# EAGLE design R113A (EAGLE 4.11)
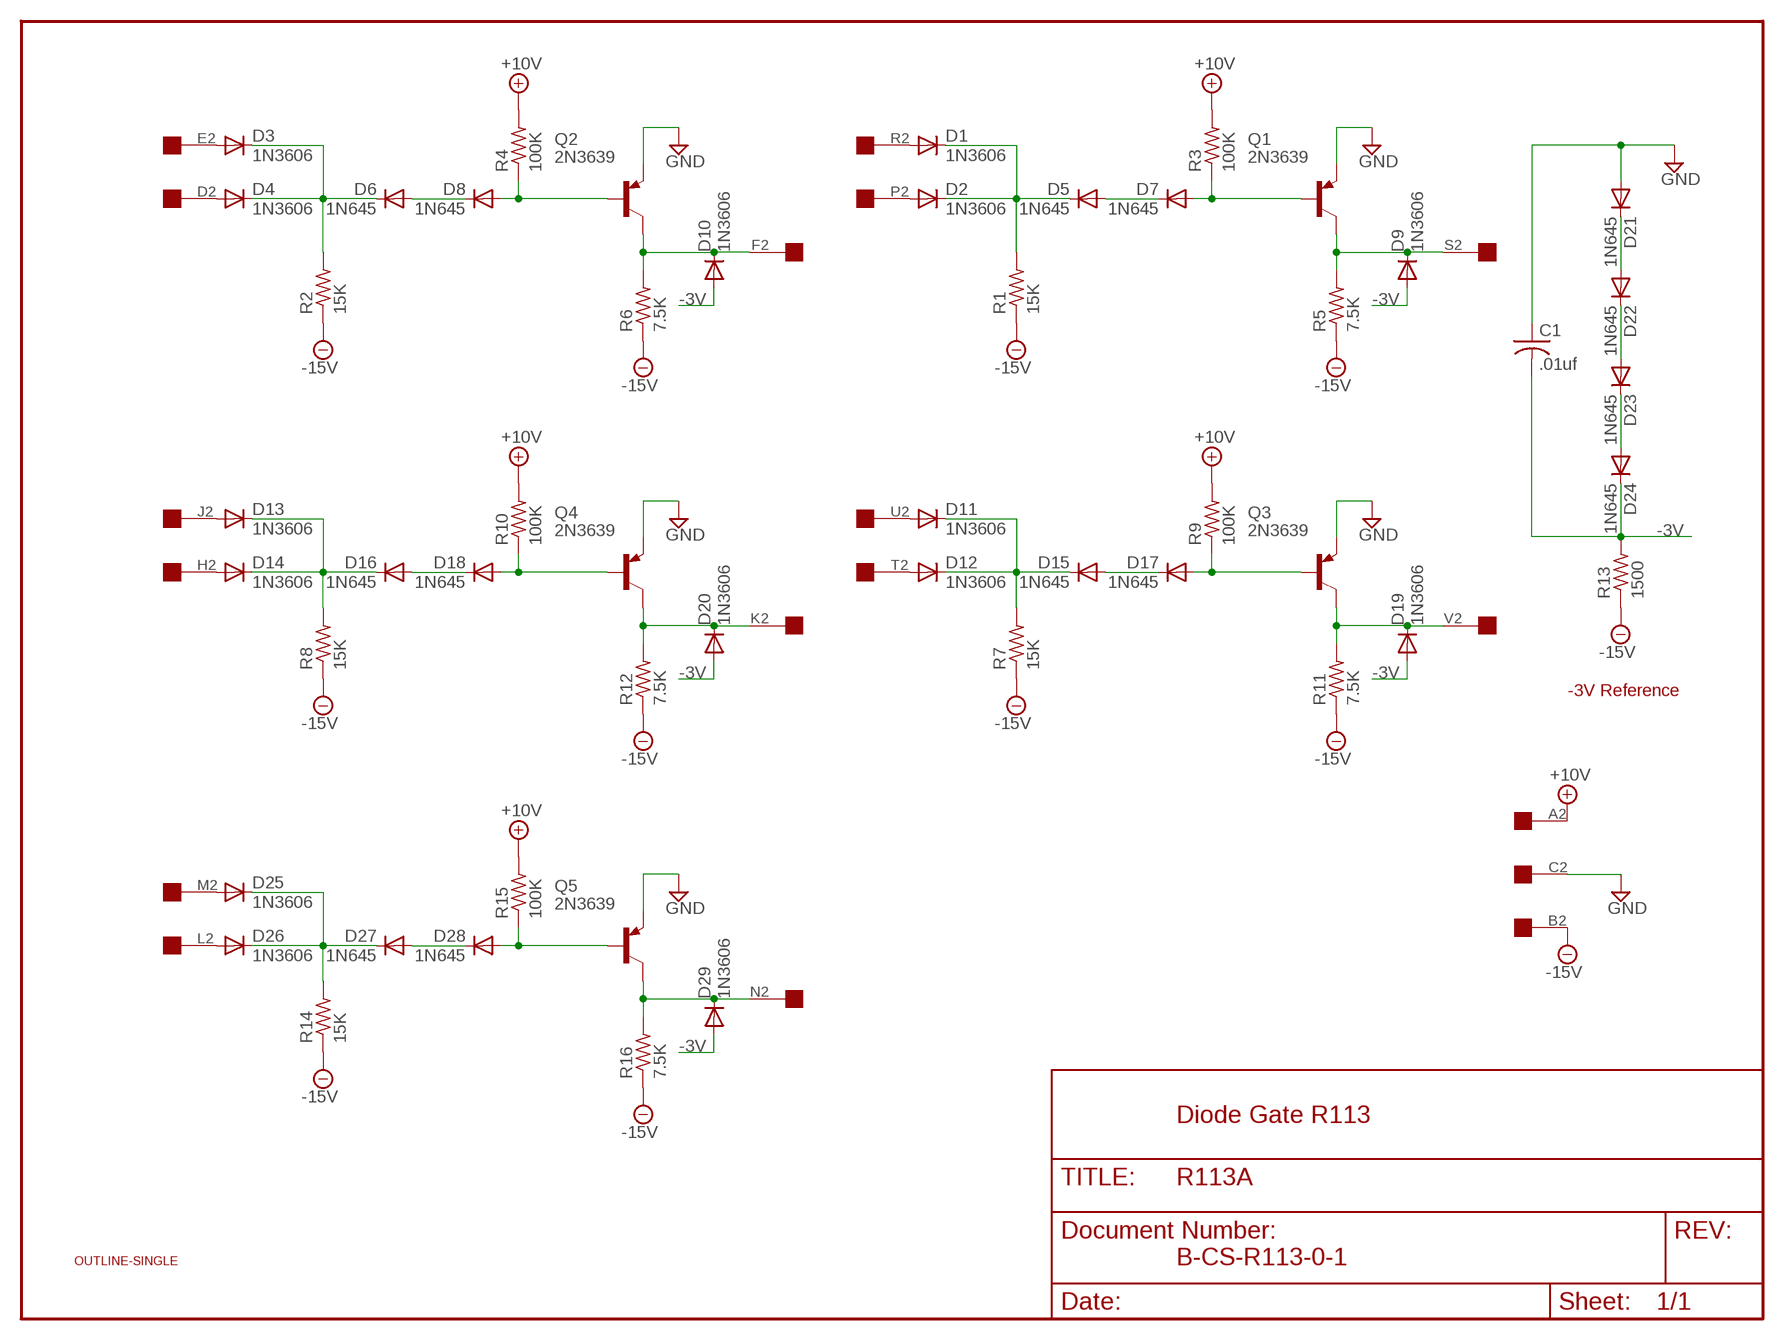
[diagram p0: schematic, sheet 1]

## Parts
C1  .01uf  C-US050-025X075  [C050-025X075]
D1  1N3606  1N4148  [DO35-10]
D2  1N3606  1N4148  [DO35-10]
D3  1N3606  1N4148  [DO35-10]
D4  1N3606  1N4148  [DO35-10]
D5  1N645  1N4148  [DO35-10]
D6  1N645  1N4148  [DO35-10]
D7  1N645  1N4148  [DO35-10]
D8  1N645  1N4148  [DO35-10]
D9  1N3606  1N4148  [DO35-10]
D10  1N3606  1N4148  [DO35-10]
D11  1N3606  1N4148  [DO35-10]
D12  1N3606  1N4148  [DO35-10]
D13  1N3606  1N4148  [DO35-10]
D14  1N3606  1N4148  [DO35-10]
D15  1N645  1N4148  [DO35-10]
D16  1N645  1N4148  [DO35-10]
D17  1N645  1N4148  [DO35-10]
D18  1N645  1N4148  [DO35-10]
D19  1N3606  1N4148  [DO35-10]
D20  1N3606  1N4148  [DO35-10]
D21  1N645  1N4148  [DO35-10]
D22  1N645  1N4148  [DO35-10]
D23  1N645  1N4148  [DO35-10]
D24  1N645  1N4148  [DO35-10]
D25  1N3606  1N4148  [DO35-10]
D26  1N3606  1N4148  [DO35-10]
D27  1N645  1N4148  [DO35-10]
D28  1N645  1N4148  [DO35-10]
D29  1N3606  1N4148  [DO35-10]
Q1  2N3639  2N3637  [TO39]
Q2  2N3639  2N3637  [TO39]
Q3  2N3639  2N3637  [TO39]
Q4  2N3639  2N3637  [TO39]
Q5  2N3639  2N3637  [TO39]
R1  15K  R-US_0207/10  [0207/10]
R2  15K  R-US_0207/10  [0207/10]
R3  100K  R-US_0207/10  [0207/10]
R4  100K  R-US_0207/10  [0207/10]
R5  7.5K  R-US_0207/10  [0207/10]
R6  7.5K  R-US_0207/10  [0207/10]
R7  15K  R-US_0207/10  [0207/10]
R8  15K  R-US_0207/10  [0207/10]
R9  100K  R-US_0207/10  [0207/10]
R10  100K  R-US_0207/10  [0207/10]
R11  7.5K  R-US_0207/10  [0207/10]
R12  7.5K  R-US_0207/10  [0207/10]
R13  1500  R-US_0207/10  [0207/10]
R14  15K  R-US_0207/10  [0207/10]
R15  100K  R-US_0207/10  [0207/10]
R16  7.5K  R-US_0207/10  [0207/10]
U$1  OUTLINE-SINGLE  [SINGLE]
U$2  EDGE-1  [EDGE-CON1]

## Nets
+10V [Power]: R3.2 R4.2 R9.2 R10.2 R15.2 U$2.A2
-3V [Power]: C1.2 D9.A D10.A D19.A D20.A D24.C D29.A R13.2
-15V [Power]: R1.1 R2.1 R5.1 R6.1 R7.1 R8.1 R11.1 R12.1 R13.1 R14.1 R16.1 U$2.B2
GND [Power]: C1.1 D21.A Q1.1(E) Q2.1(E) Q3.1(E) Q4.1(E) Q5.1(E) U$2.C2
N$1: D14.A U$2.H2
N$2: D18.A Q4.2(B) R10.1
N$3: D21.C D22.A
N$4: D20.C Q4.3(C) R12.2 U$2.K2
N$5: D11.A U$2.U2
N$6: D13.C D14.C D16.C R8.2
N$7: D16.A D18.C
N$8: D28.A Q5.2(B) R15.1
N$9: D29.C Q5.3(C) R16.2 U$2.N2
N$10: D26.A U$2.L2
N$11: D25.C D26.C D27.C R14.2
N$12: D27.A D28.C
N$13: D22.C D23.A
N$14: D13.A U$2.J2
N$15: D7.A Q1.2(B) R3.1
N$16: D23.C D24.A
N$17: D9.C Q1.3(C) R5.2 U$2.S2
N$18: D2.A U$2.P2
N$19: D8.A Q2.2(B) R4.1
N$20: D10.C Q2.3(C) R6.2 U$2.F2
N$21: D4.A U$2.D2
N$22: D3.C D4.C D6.C R2.2
N$23: D6.A D8.C
N$24: D1.C D2.C D5.C R1.2
N$25: D5.A D7.C
N$26: D17.A Q3.2(B) R9.1
N$27: D11.C D12.C D15.C R7.2
N$28: D15.A D17.C
N$29: D1.A U$2.R2
N$30: D12.A U$2.T2
N$31: D25.A U$2.M2
N$32: D19.C Q3.3(C) R11.2 U$2.V2
N$39: D3.A U$2.E2

## Notes on the sheet
- -3V Reference
- Diode Gate R113
- B-CS-R113-0-1

## Library data of the parts
C1 = rcl:C-US: CAPACITOR, American symbol
D1-D29 = diode:1N4148: DIODE high speed (Philips)
Q1-Q5 = transistor-pnp:2N3637*: PNP Transistror
R1-R16 = rcl:R-US_: RESISTOR, American symbol
U$1 = dec-con:OUTLINE-*: Board outlines for DEC boards.
U$2 = dec-con:EDGE-1: Single-Sided DEC Edge Connector -- (side 2)

## Net classes
1 Power: width 0.813 mm

## Board
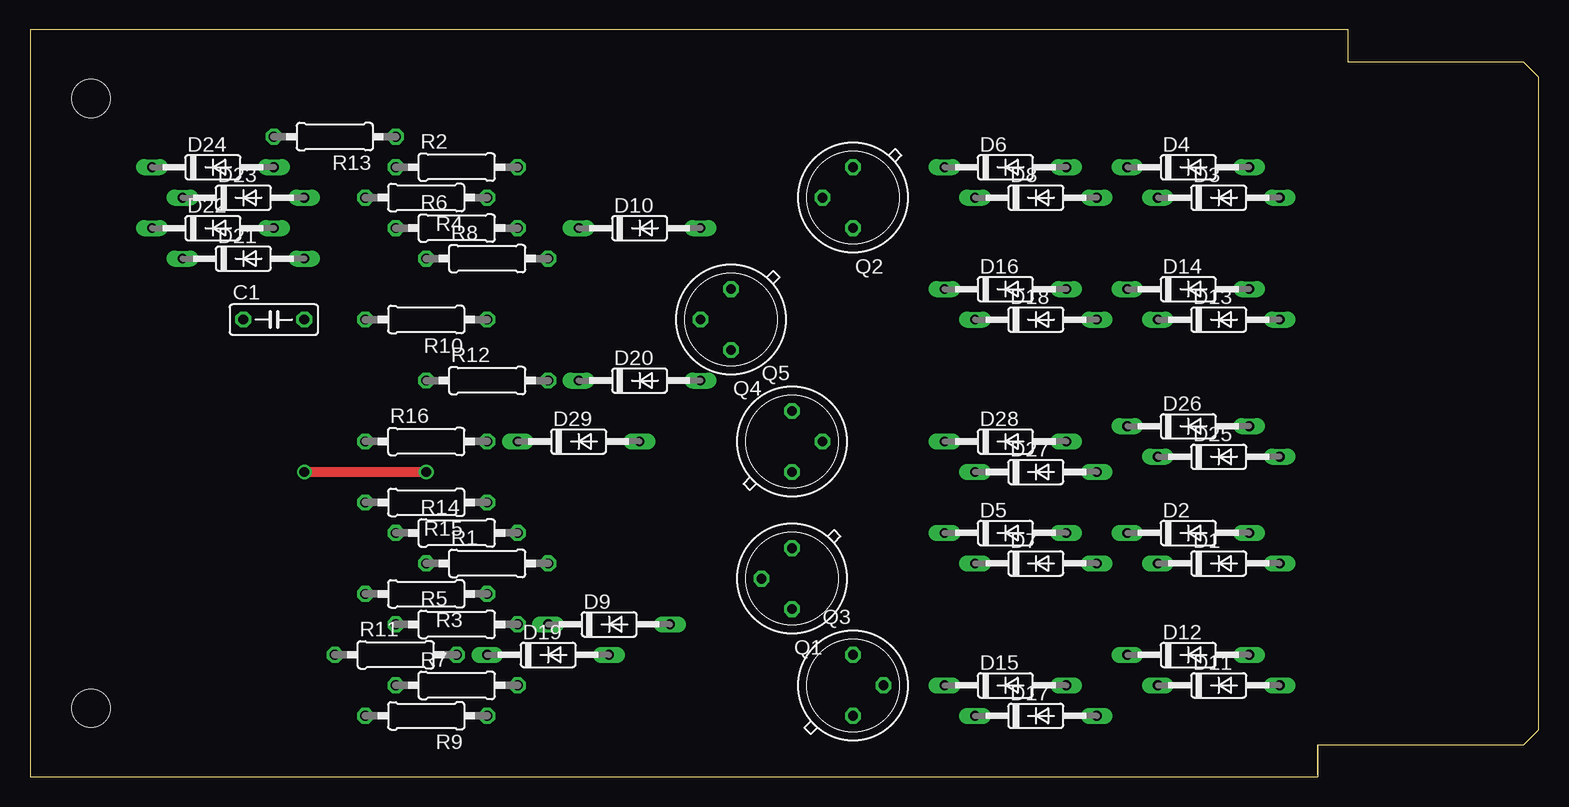
[diagram p1: board, top side]
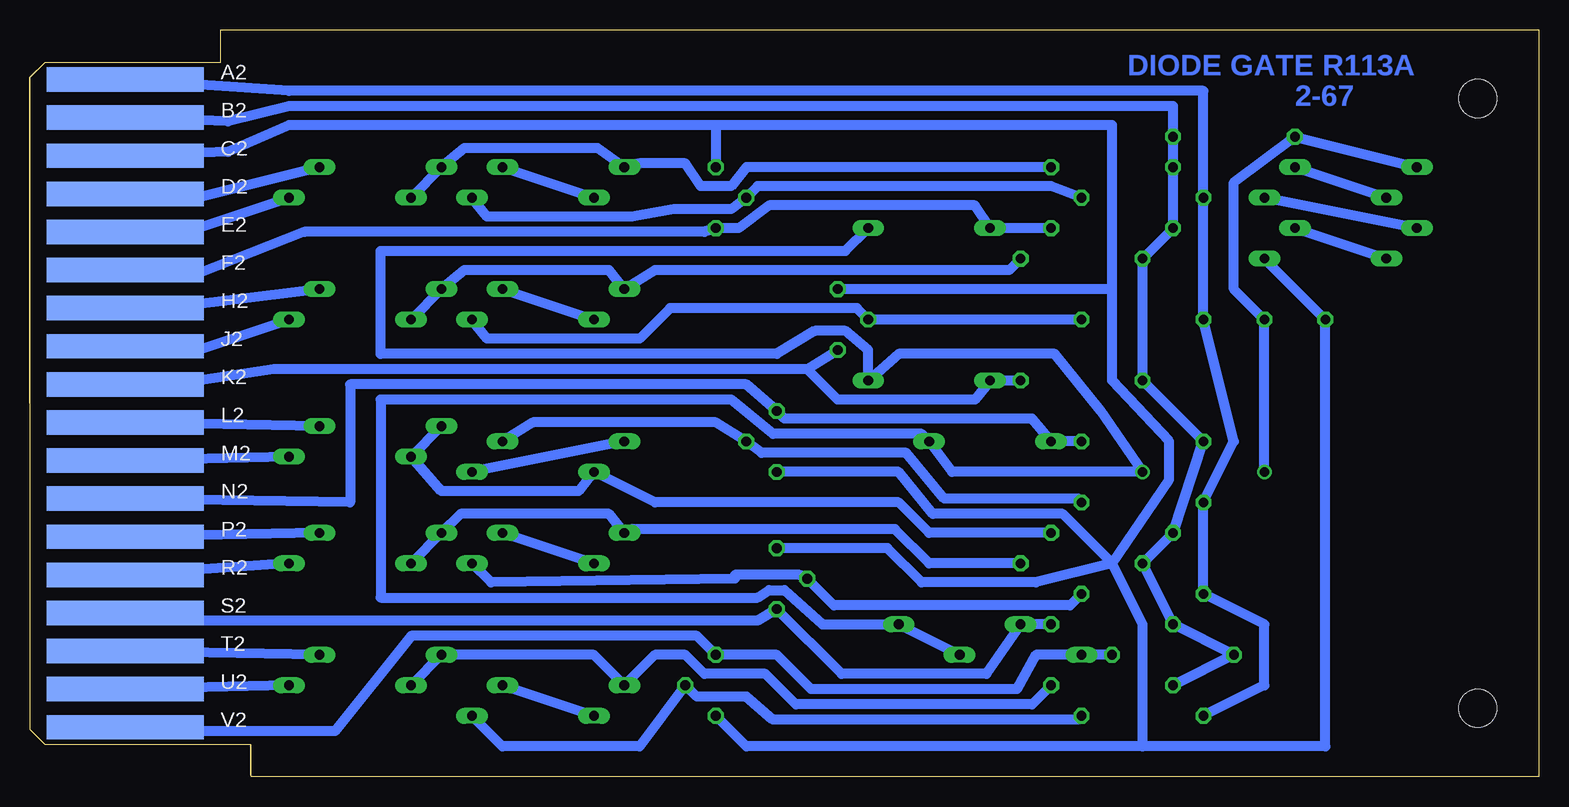
[diagram p2: board, bottom side, seen from below]

Size 125.73 x 62.23 mm. Coordinates in mm from the lower left corner, seen from the top.
Copper layers (1+16): Top 0.035mm / dielectric 1.5mm / Bottom 0.035mm
Design rules "16mils": minimum track width 16mil, minimum drill 32mil, track to track 15mil, track to pad 10mil, pad to pad 10mil, via to via 10mil, smd to smd 10mil, copper to edge 13mil, drill to drill 10mil, minimum pad ring 10mil, minimum via ring 8mil, stop-mask expansion 0mil, vias tented up to drill 0mil, thermal gap 10mil

### Footprints (pad centres in the part's own frame; a part is rotated, then mirrored left to right if it is on the bottom)
C050-025X075 = drill 0.813 octagon: 1 -2.54,0; 2 2.54,0
DO35-10 = drill 0.813 long: A 5.08,0; C -5.08,0
TO39 = drill 0.813 octagon: 1 0,-2.54; 2 2.54,0; 3 0,2.54
0207/10 = drill 0.813 octagon: 1 -5.08,0; 2 5.08,0
SINGLE = hole 3.175: 120.65,56.515; 120.65,5.715
EDGE-CON1 = smd 13.106 x 2.032 bottom: A2 7.938,4.128; B2 7.938,7.303; C2 7.938,10.477; D2 7.938,13.652; E2 7.938,16.828; F2 7.938,20.003; H2 7.938,23.177; J2 7.938,26.352; K2 7.938,29.527; L2 7.938,32.703; M2 7.938,35.877; N2 7.938,39.053; P2 7.938,42.227; R2 7.938,45.403; S2 7.938,48.578; T2 7.938,51.752; U2 7.938,54.928; V2 7.938,58.102

### Placement (x,y rotation side)
C1  20.32,38.1 0 top
D1  99.06,17.78 0 top
D2  96.52,20.32 0 top
D3  99.06,48.26 0 top
D4  96.52,50.8 0 top
D5  81.28,20.32 0 top
D6  81.28,50.8 0 top
D7  83.82,17.78 0 top
D8  83.82,48.26 0 top
D9  48.26,12.7 0 top
D10  50.8,45.72 0 top
D11  99.06,7.62 0 top
D12  96.52,10.16 0 top
D13  99.06,38.1 0 top
D14  96.52,40.64 0 top
D15  81.28,7.62 0 top
D16  81.28,40.64 0 top
D17  83.82,5.08 0 top
D18  83.82,38.1 0 top
D19  43.18,10.16 0 top
D20  50.8,33.02 0 top
D21  17.78,43.18 0 top
D22  15.24,45.72 0 top
D23  17.78,48.26 0 top
D24  15.24,50.8 0 top
D25  99.06,26.67 0 top
D26  96.52,29.21 0 top
D27  83.82,25.4 0 top
D28  81.28,27.94 0 top
D29  45.72,27.94 0 top
Q1  63.5,16.51 180 top
Q2  68.58,48.26 180 top
Q3  68.58,7.62 0 top
Q4  58.42,38.1 180 top
Q5  63.5,27.94 0 top
R1  38.1,17.78 0 top
R2  35.56,50.8 0 top
R3  33.02,15.24 180 top
R4  33.02,48.26 180 top
R5  35.56,12.7 0 top
R6  35.56,45.72 0 top
R7  35.56,7.62 0 top
R8  38.1,43.18 0 top
R9  33.02,5.08 180 top
R10  33.02,38.1 180 top
R11  30.48,10.16 0 top
R12  38.1,33.02 0 top
R13  25.4,53.34 180 top
R14  35.56,20.32 0 top
R15  33.02,22.86 180 top
R16  33.02,27.94 0 top
U$1  125.73,62.23 180 top
U$2  125.73,62.23 180 top

### Tracks (layer width: path | path; a pad name or v marks a point on that pad's centre or on a via)
+10V
  Bottom 0.813: R9.2 22.86,7.62 22.86,12.7 R3.2 R15.2 25.4,27.94 R10.2 R4.2 27.94,57.15 104.14,57.15 U$2.A2
-3V  (via drill 0.81)
  Top 0.813: v22.86,25.4 v33.02,25.4
  Bottom 0.813: D24.C R13.2 25.4,49.53 25.4,40.64 C1.2 v22.86,25.4 | D10.A 57.78,43.81 96.52,43.81 96.52,35.24 63.5,35.24 60.33,37.15 57.78,37.15 55.88,35.56 D20.A 53.34,35.24 40.32,35.24 36.51,30.48 v33.02,25.4 48.9,25.4 D29.A 51.44,28.57 63.82,28.57 67.31,31.43 96.52,31.43 96.52,14.92 65.09,14.92 64.14,15.56 62.87,15.56 59.69,12.7 D9.A D19.A
-15V
  Bottom 0.813: R7.1 R11.1 R5.1 R1.1 R14.1 R16.1 R12.1 R8.1 R6.1 R2.1 R13.1 30.48,55.88 104.14,55.88 109.22,54.61 U$2.B2
GND
  Bottom 0.813: D21.A C1.1 17.78,2.54 33.02,2.54 | 33.02,2.54 33.02,12.7 35.56,17.78 | 35.56,17.78 30.8,24.77 30.8,27.94 35.56,33.02 35.56,40.64 | 35.56,40.64 35.56,54.29 68.58,54.29 | U$2.C2 109.22,52.07 104.14,54.29 68.58,54.29 | 68.58,54.29 Q2.1 | 35.56,40.64 Q4.1 | 35.56,17.78 39.69,21.91 50.48,21.91 53.34,25.4 Q5.1 | 33.02,2.54 66.04,2.54 Q3.1 | Q1.1 54.29,19.05 51.44,16.19 41.91,16.19 35.56,17.78
N$1
  Bottom 0.813: U$2.H2 111.76,39.37 D14.A
N$2
  Bottom 0.813: R10.1 Q4.2 56.83,39.05 72.39,39.05 74.93,36.51 87.63,36.51 D18.A
N$3
  Bottom 0.813: D21.C D22.A
N$4
  Bottom 0.813: 60.96,33.97 105.41,33.97 111.76,33.02 U$2.K2 | 60.96,33.97 Q4.3 | R12.2 D20.C 46.99,31.43 58.42,31.43 60.96,33.97
N$5
  Bottom 0.813: D11.A U$2.U2
N$6
  Bottom 0.813: D13.C D14.C 89.53,42.23 77.47,42.23 D16.C 73.66,42.23 44.13,42.23 R8.2
N$7
  Bottom 0.813: D18.C D16.A
N$8
  Bottom 0.813: D28.A 83.82,29.53 68.58,29.53 Q5.2 64.77,26.99 52.7,26.99 49.53,23.18 38.42,23.18 R15.1
N$9
  Bottom 0.813: R16.2 D29.C 42.23,29.84 62.87,29.84 Q5.3 63.82,30.8 66.04,32.7 99.06,32.7 99.06,22.86 U$2.N2
N$10
  Bottom 0.813: D26.A U$2.L2
N$11
  Bottom 0.813: D26.C D25.C 91.44,23.81 80.01,23.81 D27.C 73.66,22.86 53.34,22.86 50.8,20.32 R14.2
N$12
  Bottom 0.813: D28.C D27.A
N$13
  Bottom 0.813: D22.C D23.A
N$14
  Bottom 0.813: U$2.J2 111.76,35.56 D13.A
N$15
  Bottom 0.813: R3.1 39.05,14.29 58.74,14.29 Q1.2 61.59,16.83 66.99,16.83 66.99,16.51 87.31,16.19 D7.A
N$16
  Bottom 0.813: D23.C D24.A
N$17
  Bottom 0.813: U$2.S2 111.44,13.02 65.09,13.02 Q1.3 58.1,8.57 46.04,8.57 D9.C R5.2
N$18
  Bottom 0.813: D2.A U$2.P2
N$19
  Bottom 0.813: D8.A 87.63,46.67 75.56,46.67 72.07,47.31 67.31,47.31 Q2.2 65.09,49.21 40.64,49.21 R4.1
N$20
  Bottom 0.813: R6.2 D10.C 46.99,47.62 64.14,47.62 66.67,45.72 Q2.3 69.53,45.4 102.87,45.4 111.76,41.91 U$2.F2
N$21
  Bottom 0.813: U$2.D2 111.76,48.26 D4.A
N$22
  Bottom 0.813: D3.C D4.C 89.53,52.39 78.42,52.39 D6.C 74.93,51.12 71.12,51.12 69.85,49.21 67.31,49.21 66.04,50.8 R2.2
N$23
  Bottom 0.813: D8.C D6.A
N$24
  Bottom 0.813: D1.C D2.C 89.85,21.91 77.47,21.91 D5.C 75.56,20.64 53.66,20.64 50.8,17.78 R1.2
N$25
  Bottom 0.813: D7.C D5.A
N$26
  Bottom 0.813: D17.A 86.36,2.54 74.93,2.54 Q3.2 70.17,6.67 66.04,6.67 63.82,4.76 38.42,4.76 R9.1
N$27
  Bottom 0.813: D11.C D12.C 78.74,10.16 D15.C 73.66,10.16 71.12,10.16 69.53,8.57 64.45,8.57 61.91,6.03 42.23,6.03 R7.2
N$28
  Bottom 0.813: D17.C D15.A
N$29
  Bottom 0.813: D1.A U$2.R2
N$30
  Bottom 0.813: D12.A U$2.T2
N$31
  Bottom 0.813: D25.A U$2.M2
N$32
  Bottom 0.813: U$2.V2 111.76,3.81 100.33,3.81 93.98,11.75 70.17,11.75 Q3.3 63.5,10.16 60.64,7.3 43.5,7.3 41.91,10.16 D19.C R11.2
N$39
  Bottom 0.813: U$2.E2 111.76,45.72 D3.A

### Text on the board
Bottom: DIODE GATE R113A | 2-67